# EAGLE design doorbellphat (EAGLE 9.5.2)
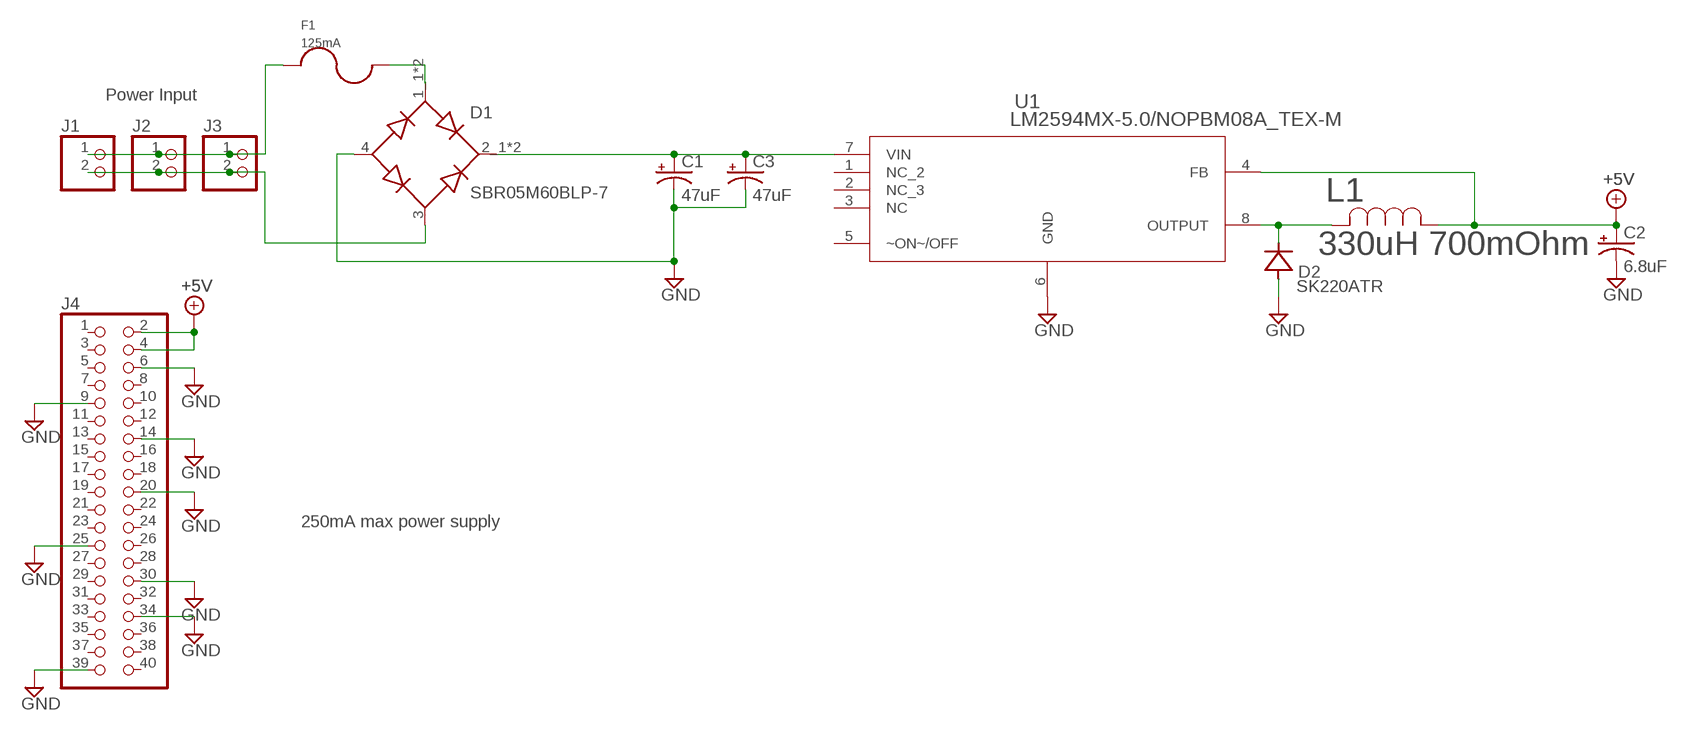
[diagram p0: schematic, sheet 1]

## Parts
C1  47uF  CPOL-US2917  [CAPPM7343X310N]
C2  6.8uF  CPOL-US2312  [2312]
C3  47uF  CPOL-US2917  [CAPPM7343X310N]
D1  SBR05M60BLP-7  [RECTIFIER_SBR05M60BLP-7]
D2  SK220ATR  MBRA340T3  [SMA]
F1  125mA  PICO3  [0603]
J1  PINHD-1X2  [1X02]
J2  PINHD-1X2  [1X02]
J3  PINHD-1X2  [1X02]
J4  PINHD-2X20  [2X20]
L1  330uH 700mOhm  SRU1038-331Y  [IND_BOURNS_SRU1038]
U1  LM2594MX-5.0/NOPBM08A_TEX-M  [M08A_TEX-M]

## Nets
+5V: C2.A(+) J4.2 J4.4 L1.1 U1.4(FB)
GND: C1.C(-) C2.C(-) C3.C(-) D1.4(-) D2.A J4.6 J4.9 J4.14 J4.20 J4.25 J4.30 J4.34 J4.39 U1.6(GND)
N$1: D1.3(AC2) J1.2 J2.2 J3.2
N$2: F1.1 J1.1 J2.1 J3.1
N$3: D2.C L1.2 U1.8(OUTPUT)
N$4: D1.1_1(AC1) D1.1_2(AC1) F1.2
N$5: C1.A(+) C3.A(+) D1.2_1(+) D1.2_2(+) U1.7(VIN)
Unconnected: J4.1 J4.3 J4.5 J4.7 J4.8 J4.10 J4.11 J4.12 J4.13 J4.15 J4.16 J4.17 J4.18 J4.19 J4.21 J4.22 J4.23 J4.24 J4.26 J4.27 J4.28 J4.29 J4.31 J4.32 J4.33 J4.35 J4.36 J4.37 J4.38 J4.40 U1.1(NC_2) U1.2(NC_3) U1.3(NC) U1.5(~ON~/OFF)

## Notes on the sheet
- Power Input
- 250mA max power supply

## Library data of the parts
C1 C3 = TBB - rcl:CPOL-US: POLARIZED CAPACITOR, American symbol; MFR_PART_NO: TAJD476M035RNJV
C2 = TBB - rcl:CPOL-US: POLARIZED CAPACITOR, American symbol; MFR_PART_NO: 293D685X9035C2TE3
D1 = SBR05M60BLP-7:SBR05M60BLP-7: SBR05M60BLP 60 V 0.5 A Surface Mount Bridge Super Barrier Rectifier - DFN3030-4; ARROW_ELECTRONICS-PURCHASE-URL: https://snapeda.com/shop?store=Arrow+Electronics&id=557055; DESCRIPTION: Bridge Rectifier Single Phase Super Barrier 60V Surface Mount U-DFN3030-4; DIGI-KEY_PART_NUMBER: SBR05M60BLPDICT-ND; DIGIKEY-PURCHASE-URL: https://snapeda.com/shop?store=DigiKey&id=557055; MF: Diodes Inc.; MOUSER-PURCHASE-URL: https://snapeda.com/shop?store=Mouser&id=557055; MP: SBR05M60BLP-7; PACKAGE: DFN-4 Diodes Inc.
D2 = diode:MBRA340T3: Surface Mount Schottky Power Rectifier Source: http://www.onsemi.com/pub_link/Collateral/MBRA340T3-D.PDF
F1 = TBB - fuse:PICO3; DESCRIPTION: FUSE BOARD MNT 100MA 32VDC; MANUFACTURER: AVX; MFR_PART_NO: F0603G0R10FNTR; PACKAGE: 0603; VENDOR: DIGIKEY
J1-J3 = TBB - pinhead:PINHD-1X2: PIN HEADER
J4 = TBB - pinhead:PINHD-2X20: PIN HEADER
L1 = SBR05M60BLP-7:SRU1038-331Y; MFR_PART_NO: SRU1038-331Y
U1 = SBR05M60BLP-7:LM2594MX-5.0/NOPB; BUILT_BY: EMA_UL_Team; MANUFACTURER_PART_NUMBER: LM2594MX-5.0/NOPB; SOURCELIBRARY: National_2014-06-20; VENDOR: Texas Instruments

## Net classes
0 default: width 0.61 mm, clearance 0.305 mm
1 AC: width 0.61 mm, clearance 0.61 mm

## Board
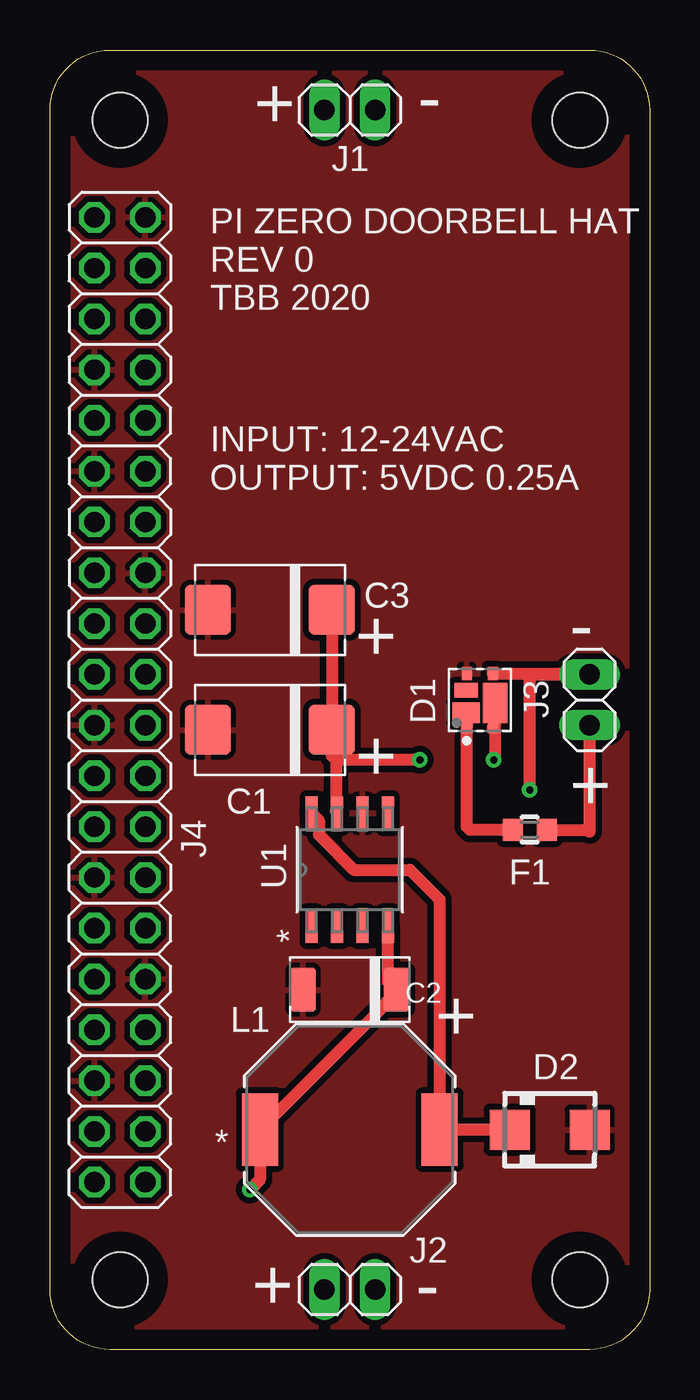
[diagram p1: board, top side]
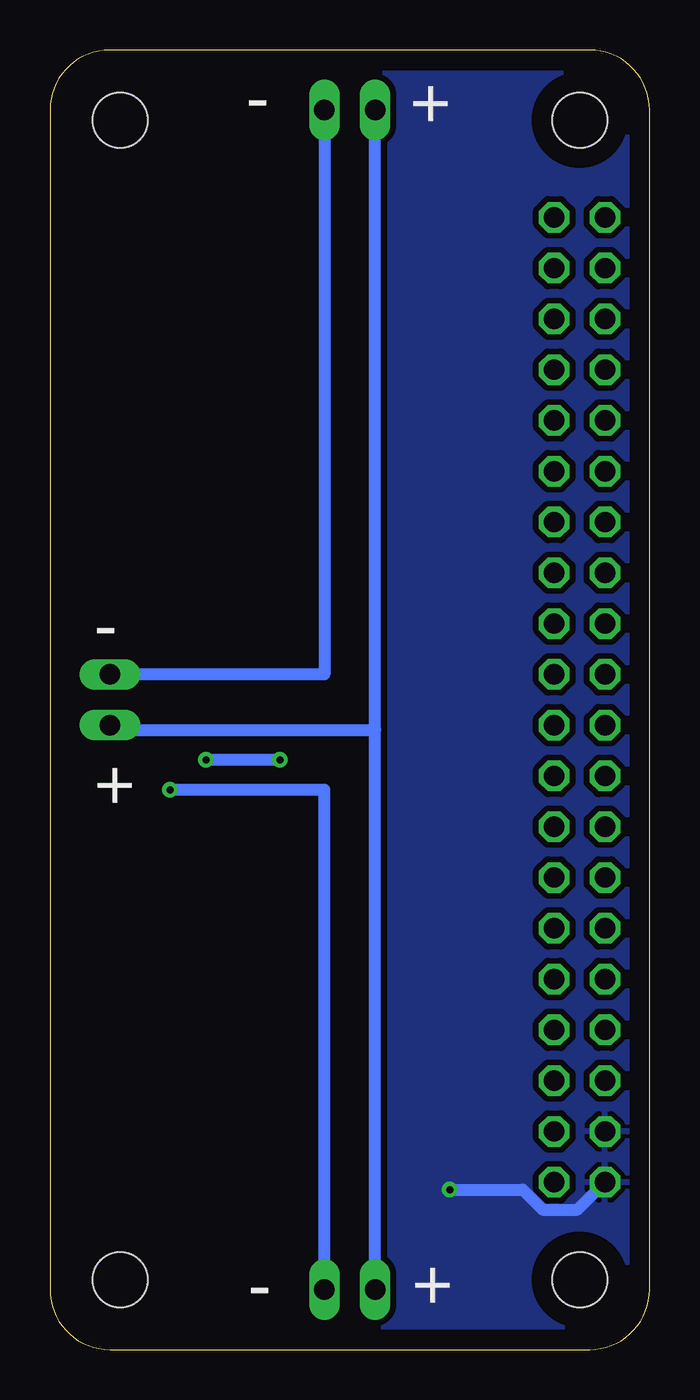
[diagram p2: board, bottom side, seen from below]

Size 30 x 65 mm. Coordinates in mm from the lower left corner, seen from the top.
Outline: 0,3 0,62 arc-90 3,65 27,65 arc-90 30,62 30,3 arc-90 27,0 3,0 arc-90 0,3
Copper layers (1*16): Top 0.035mm / dielectric 0.15mm / Bottom 0.035mm
Design rules "default *": minimum track width 24mil, minimum drill 0.35mm, track to track 6mil, track to pad 6mil, pad to pad 6mil, via to via 6mil, smd to smd 6mil, copper to edge 40mil, drill to drill 6mil, minimum pad ring 10mil, minimum via ring 8mil, stop-mask expansion 4mil, vias tented up to drill 0mil, thermal gap 10mil
Holes 2.75 mm at 3.5,3.5 26.5,3.5 26.5,61.5 3.5,61.5

### Footprints (pad centres in the part's own frame; a part is rotated, then mirrored left to right if it is on the bottom)
CAPPM7343X310N = smd 2.31 x 2.52: A -3.1,0; C 3.1,0
2312 = smd 1.295 x 2.21: A -2.338,0; C 2.338,0
RECTIFIER_SBR05M60BLP-7 = smd 0.5 x 0.5: 1_1 -1.4,0.65; 2_1 -1.4,-0.65 | smd 1.015 x 1.375: 1_2 -0.642,0.688 | smd 1.98 x 1.225: 2_2 -0.16,-0.762 | smd 0.65 x 0.5: 3 1.325,-0.65; 4 1.325,0.65 | smd 0.715 x 1.175: 5 0.472,0.688
SMA = smd 2 x 2: A 2,0; C -2,0
0603 = smd 1 x 1.1: 1 -0.85,0; 2 0.85,0
1X02 = drill 1.016 long: 1 -1.27,0; 2 1.27,0
2X20 = drill 1.016 octagon: 1 -24.13,-1.27; 2 -24.13,1.27; 3 -21.59,-1.27; 4 -21.59,1.27; 5 -19.05,-1.27; 6 -19.05,1.27; 7 -16.51,-1.27; 8 -16.51,1.27; 9 -13.97,-1.27; 10 -13.97,1.27; 11 -11.43,-1.27; 12 -11.43,1.27; 13 -8.89,-1.27; 14 -8.89,1.27; 15 -6.35,-1.27; 16 -6.35,1.27; 17 -3.81,-1.27; 18 -3.81,1.27; 19 -1.27,-1.27; 20 -1.27,1.27; 21 1.27,-1.27; 22 1.27,1.27; 23 3.81,-1.27; 24 3.81,1.27; 25 6.35,-1.27; 26 6.35,1.27; 27 8.89,-1.27; 28 8.89,1.27; 29 11.43,-1.27; 30 11.43,1.27; 31 13.97,-1.27; 32 13.97,1.27; 33 16.51,-1.27; 34 16.51,1.27; 35 19.05,-1.27; 36 19.05,1.27; 37 21.59,-1.27; 38 21.59,1.27; 39 24.13,-1.27; 40 24.13,1.27
IND_BOURNS_SRU1038 = smd 1.803 x 3.607: 1 -4.496,0; 2 4.496,0
M08A_TEX-M = smd 1.664 x 0.61: 1 -2.826,1.905; 2 -2.826,0.635; 3 -2.826,-0.635; 4 -2.826,-1.905; 5 2.826,-1.905; 6 2.826,-0.635; 7 2.826,0.635; 8 2.826,1.905

### Placement (x,y rotation side)
C1  11,31 180 top
C2  15,18 180 top
C3  11,37 180 top
D1  21.5,32.5 90 top
D2  25,11 0 top
F1  24,26 180 top
J1  15,62 0 top
J2  15,3 0 top
J3  27,32.5 90 top
J4  3.5,32.5 90 top
L1  15,11 0 top
U1  15,24 90 top

### Tracks (layer width: path | path; a pad name or v marks a point on that pad's centre or on a via)
+5V  (via drill 0.35)
  Top 0.61: U1.4 16.91,18.41 C2.A 16.5,17 L1.1 10.5,8.5 v10,8
  Bottom 0.61: v10,8 6.34,8 5.34,7 3.6,7 J4.2
  pour Bottom: -1,-1 -1,66 31,66 31,-1
GND
  pour Top: -1,-1 -1,66 31,66 31,-1
N$1  (via drill 0.35)
  Top 0.61: v24,28 24,33.77 J3.2 27,33.83 D1.3
  Bottom 0.61: J1.2 16.27,33.77 J3.2 | J2.2 16.27,28 v24,28
N$2
  Top 0.61: J3.1 27,25.91 26.91,26 F1.1
  Bottom 0.61: J2.1 13.73,31 | 13.73,31 J1.1 | J3.1 27,31 13.73,31
N$3
  Top 0.61: U1.8 13.45,26.47 13.45,25.74 15.19,24 18,24 19.5,22.5 L1.2 D2.C
N$4
  Top 0.61: F1.2 21,26 20.85,26.15 D1.1_1 20.85,31.82 D1.1_2
N$5  (via drill 0.35)
  Top 0.61: v22.2,29.5 22.25,29.5 22.25,31 D1.2_1 22.26,31.21 D1.2_2 | C3.A C1.A 14.1,29.7 14.3,29.5 | v18.5,29.5 14.3,29.5 | 14.3,29.5 14.3,26.91 14.37,26.85 U1.7
  Bottom 0.61: v18.5,29.5 v22.2,29.5

### Text on the board
tPlace: + | - | PI ZERO DOORBELL HAT / REV 0 / TBB 2020 | INPUT: 12-24VAC / OUTPUT: 5VDC 0.25A | - | + | + | -
bPlace: + | - | - | + | + | -